# EAGLE schematic OpenLCD-Dimension For Spec (EAGLE 7.2.0)
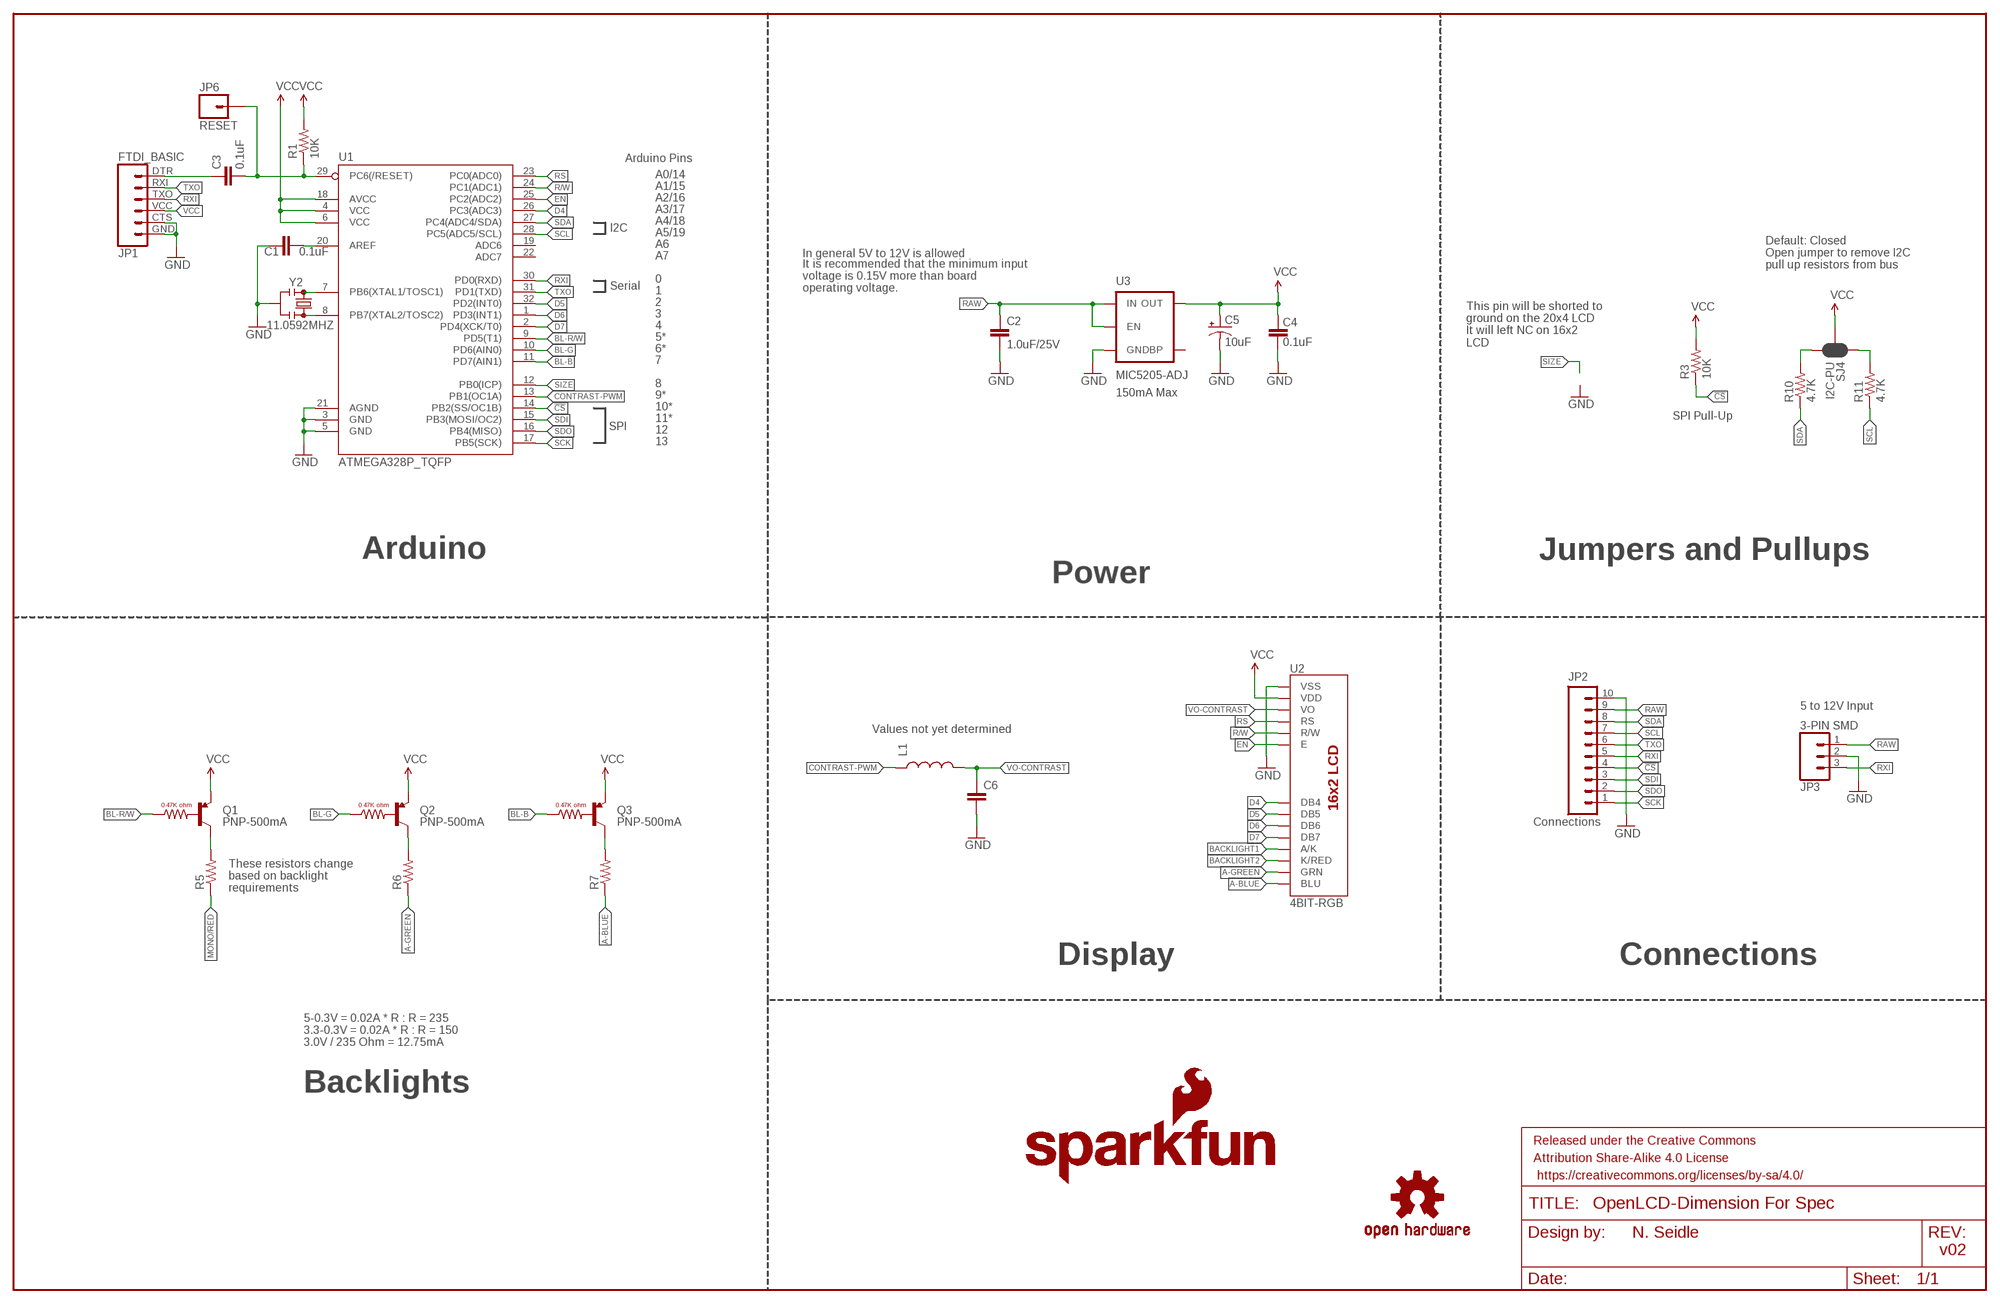
[diagram p0: schematic, sheet 1]

## Parts
C1  0.1uF  0.1UF-25V(+80/-20%)(0603)  [0603-CAP]
C2  1.0uF/25V  1.0UF-25V-+80/-20(0805)"  [0805-CAP]
C3  0.1uF  0.1UF-25V(+80/-20%)(0603)  [0603-CAP]
C4  0.1uF  0.1UF-25V(+80/-20%)(0603)  [0603-CAP]
C5  10uF  10UF-16V-10%(TANT)  [EIA3216]
C6  CAP0603-CAP  [0603-CAP]
FRAME1  FRAME-LEDGER  [CREATIVE_COMMONS]
JP1  FTDI_BASIC  FTDI_BASICPTH  [FTDI_BASIC]
JP2  Connections  M10SILK_FEMALE_PTH  [1X10]
JP3  3-PIN SMD  M03JST-PTH-VERT  [JST-3-PTH-VERT]
JP6  RESET  M01PTH  [1X01]
L1  INDUCTOR0603  [0603]
LOGO1  SFE_LOGO_NAME_FLAME.1_INCH  [SFE_LOGO_NAME_FLAME_.1]
Q1  PNP-500mA  TRANSISTOR-PNP-DDTB142TC  [SOT23-3]
Q2  PNP-500mA  TRANSISTOR-PNP-DDTB142TC  [SOT23-3]
Q3  PNP-500mA  TRANSISTOR-PNP-DDTB142TC  [SOT23-3]
R1  10K  10KOHM-1/10W-1%(0603)0603  [0603-RES]
R3  10K  10KOHM-1/10W-1%(0603)0603  [0603-RES]
R5  240  240OHM1/10W1%(0603)  [0603-RES]
R6  240  240OHM1/10W1%(0603)  [0603-RES]
R7  240  240OHM1/10W1%(0603)  [0603-RES]
R10  4.7K  4.7KOHM-1/10W-1%(0603)  [0603-RES]
R11  4.7K  4.7KOHM-1/10W-1%(0603)  [0603-RES]
SJ4  I2C-PU  JUMPER-PAD-3-NC_BY_PASTE  [PAD-JUMPER-3-NC_BY_PASTE_YES_SILK_FULL_BOX]
U1  ATMEGA328P_TQFP  [TQFP32-08]
U2  4BIT-RGB  LCD-16X2-MINMIN4-RGB  [LCD-16X2_NOSILK-KIT-4BIT]
U3  MIC5205-ADJ  V_REG_MIC5205ADJ  [SOT23-5]
U$4  OSHW-LOGOS  [OSHW-LOGO-S]
Y2  11.0592MHZ  RESONATOR8MHZ  [RESONATOR-SMD]

## Nets
!CS: JP2.4 R3.1 U1.14(PB2(SS/OC1B))
A-BLUE: R7.1 U2.18(BLU)
A-GREEN: R6.1 U2.17(GRN)
AREF: C1.2 U1.20(AREF)
BACKLIGHT1: U2.15(A/K)
BACKLIGHT2: U2.16(K/RED)
BL-B: Q3.1(B) U1.11(PD7(AIN1))
BL-G: Q2.1(B) U1.10(PD6(AIN0))
BL-R/W: Q1.1(B) U1.9(PD5(T1))
CONTRAST-PWM: L1.1 U1.13(PB1(OC1A))
D4: U1.26(PC3(ADC3)) U2.11(DB4)
D5: U1.32(PD2(INT0)) U2.12(DB5)
D6: U1.1(PD3(INT1)) U2.13(DB6)
D7: U1.2(PD4(XCK/T0)) U2.14(DB7)
DTR: C3.1 JP1.DTR
EN: U1.25(PC2(ADC2)) U2.6(E)
GND: C1.1 C2.2 C4.1 C5.C(-) C6.2 JP1.CTS JP1.GND JP2.10 JP3.2 U1.3(GND) U1.5(GND) U1.21(AGND) U2.1(VSS) U3.2(GND) Y2.2
MONO/RED: R5.1
N$1: Q1.3(C) R5.2
N$2: U1.8(PB7(XTAL2/TOSC2)) Y2.3
N$3: U1.7(PB6(XTAL1/TOSC1)) Y2.1
N$4: Q2.3(C) R6.2
N$5: Q3.3(C) R7.2
N$9: R11.2 SJ4.1
N$10: R10.2 SJ4.3
R/W: U1.24(PC1(ADC1)) U2.5(R/W)
RAW [vcc]: C2.1 JP2.9 JP3.1 U3.1(IN) U3.3(EN)
RS: U1.23(PC0(ADC0)) U2.4(RS)
RST: C3.2 JP6.1 R1.1 U1.29(PC6(/RESET))
RXI: JP1.TXO JP2.5 JP3.3 U1.30(PD0(RXD))
SCK: JP2.1 U1.17(PB5(SCK))
SCL: JP2.7 R11.1 U1.28(PC5(ADC5/SCL))
SDA: JP2.8 R10.1 U1.27(PC4(ADC4/SDA))
SDI: JP2.3 U1.15(PB3(MOSI/OC2))
SDO: JP2.2 U1.16(PB4(MISO))
SIZE: U1.12(PB0(ICP))
TXO: JP1.RXI JP2.6 U1.31(PD1(TXD))
VCC: C4.2 C5.A(+) JP1.VCC Q1.2(E) Q2.2(E) Q3.2(E) R1.2 R3.2 SJ4.2 U1.4(VCC) U1.6(VCC) U1.18(AVCC) U2.2(VDD) U3.5(OUT)
VO-CONTRAST: C6.1 L1.2 U2.3(VO)
Unconnected: U1.19(ADC6) U1.22(ADC7) U3.4(BP)

## Notes on the sheet
- Arduino Pins
- A0/14
- A1/15
- A2/16
- A3/17
- A4/18
- I2C
- A5/19
- A6
- A7 | In general 5V to 12V is allowed
- Default: Closed
  Open jumper to remove I2C
  pull up resistors from bus
- 0
- Serial
- It is recommended that the minimum input
  voltage is 0.15V more than board
  operating voltage.
- 1
- 2
- 3
- 4
- 5*
- This pin will be shorted to
  ground on the 20x4 LCD
  It will left NC on 16x2
  LCD
- 6*
- 7
- 8
- 9* | 150mA Max
- 10*
- 11* | SPI Pull-Up
- SPI
- 12
- 13
- Arduino | Jumpers and Pullups
- Power
- 5 to 12V Input
- Values not yet determined
- These resistors change
  based on backlight
  requirements
- Display | Connections
- 5-0.3V = 0.02A * R : R = 235
  3.3-0.3V = 0.02A * R : R = 150
  3.0V / 235 Ohm = 12.75mA
- Backlights
- N. Seidle
- v02

## Library data of the parts
C1 C3 C4 = SparkFun-Capacitors:0.1UF-25V(+80/-20%)(0603): CAP-00810 Ceramic Standard decoupling cap; PROD_ID: CAP-00810
C2 = SparkFun-Capacitors:1.0UF-25V-+80/-20(0805): CAP-11625; PROD_ID: CAP-11625; VALUE: 1.0uF
C5 = SparkFun-Capacitors:10UF-16V-10%(TANT): CAP-00811 1206/EIA-3216 Tantalum capacitor; PROD_ID: CAP-00811
C6 = SparkFun-Passives:CAP: Capacitor Standard 0603 ceramic capacitor, and 0.1" leaded capacitor.
FRAME1 = SparkFun-Aesthetics:FRAME-LEDGER: Schematic Frame Standard 11x14 US Ledger frame
JP1 = SparkFun:FTDI_BASIC: FTDI Basic: 3.3V and 5V
JP2 = SparkFun-Connectors:M10: Header 10 Standard 10-pin 0.1" header. Use with straight break away headers (SKU : PRT-00116), right angle break away headers (PRT-00553), swiss pins (PRT-00743), machine pins (PRT-00117), and female headers (PRT-00115).; PROD_ID: CONN-11563
JP3 = SparkFun-Connectors:M03: Header 3 Standard 3-pin 0.1" header. Use with straight break away headers (SKU : PRT-00116), right angle break away headers (PRT-00553), swiss pins (PRT-00743), machine pins (PRT-00117), and female headers (PRT-00115). Molex polarized connector foot print use with SKU : PRT-08232 with associated crimp pins and housings.
JP6 = SparkFun-Connectors:M01: Header 1 Standard 1-pin 0.1" header. Use with straight break away headers (SKU : PRT-00116), right angle break away headers (PRT-00553), swiss pins (PRT-00743), machine pins (PRT-00117), and female headers (PRT-00115). SMTSO-256-ET is a "flush mount" nut for a 4-40 screw. The older package used to be too tight, and did not allow it to sit properly thru the drill hit. The latest (0.165DIA) fits nice and snug.
L1 = SparkFun-Passives:INDUCTOR: Inductors Basic Inductor/Choke - 0603 and 1206. Footprints are not proven and vary greatly between part numbers. INDUCTOR POWER 3.3UH 4.0A SMD 0.197" L x 0.197" W x 0.177" H (5.00mm x 5.00mm x 4.50mm)
LOGO1 = SparkFun-Aesthetics:SFE_LOGO_NAME_FLAME: SFE Logo, name and flame This is the SparkFun full logo. The logo on the schematic will always be the same size; the package variant is the height of the flame part of the logo. Default layer for the logo on the board is tSilk.
Q1-Q3 = SparkFun-DiscreteSemi:TRANSISTOR-PNP-DDTB142TC: PNP transistor with base resistor.; PROD_ID: TRANS-11479
R1 R3 = SparkFun-Resistors:10KOHM-1/10W-1%(0603): RES-00824; PROD_ID: RES-00824
R5-R7 = SparkFun-Resistors:240OHM1/10W1%(0603): RES-07849; PROD_ID: RES-07849
R10 R11 = SparkFun-Resistors:4.7KOHM-1/10W-1%(0603): RES-07857; PROD_ID: RES-07857
SJ4 = SparkFun-Passives:JUMPER-PAD-3-NC_BY_PASTE
U1 = SparkFun-DigitalIC:ATMEGA328P_TQFP; PROD_ID: IC-09069
U2 = SparkFun-Displays:LCD-16X2-MIN
U3 = SparkFun-PowerIC:V_REG_MIC5205: V_REG MIC5205 Standard 3.3V, 5V, and Adjustable 150mA LDO voltage regulator in SOT-23 layout. Micrel part MIC5205. BP (by-pass) pin is used to lower output noise with 470pF cap, may be left open. On the adjustable version BP is used to set output.; PROD_ID: VREG-12594; VALUE: ADJ
U$4 = SparkFun-Aesthetics:OSHW-LOGO: Open Source Hardware Logo This logo indicates the piece of hardware it is found on incorporates a OSHW license and/or adheres to the definition of open source hardware found here: http://freedomdefined.org/OSHW
Y2 = SparkFun-FreqCtrl:RESONATOR: Resonator Small SMD resonator. Used, eg, on the Arduino Pro/ Pro Mini boards. 8MHz- XTAL-08895 16MHz- XTAL-08900; PROD_ID: XTAL-08895; VALUE: 8MHZ

## Net classes
0 default: width 0.203 mm